# Altium schematic sheet rp3a0-mini-misc.SchDoc
size A4; SheetNumber: 6; SheetTotal: 6
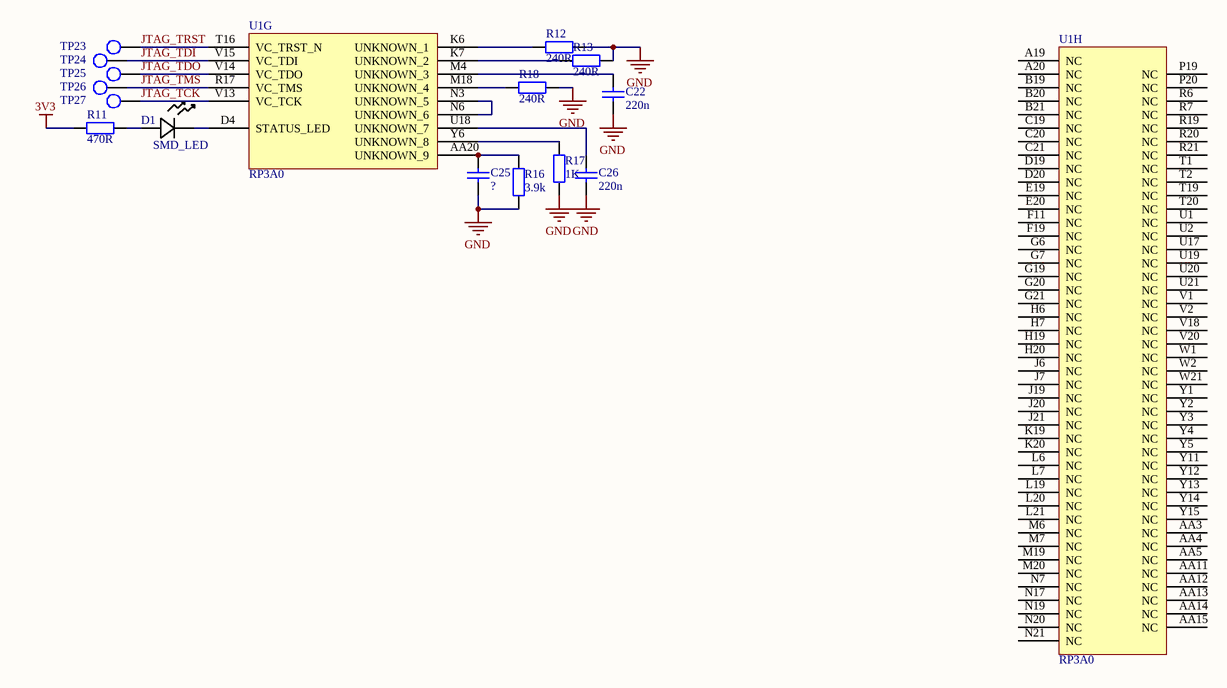
[diagram p0: rp3a0-mini-misc.SchDoc]

## Parts
C22  value 220n  [0402]  (hidden comment: Cap)
C25  Cap  [0402]  (value not drawn)
C26  value 220n  [0402]  (hidden comment: Cap)
D1  SMD_LED  [LED_0603]
R11  value 470R  [RES-0402-SML]  (hidden comment: Res SMD)
R12  value 240R  [RES-0402-SML]  (hidden comment: Res SMD)
R13  value 240R  [RES-0402-SML]  (hidden comment: Res SMD)
R16  value 3.9k  [RES-0402-SML]  (hidden comment: Res SMD)
R17  value 1K  [RES-0402-SML]  (hidden comment: Res SMD)
R18  value 240R  [RES-0402-SML]  (hidden comment: Res SMD)
TP23  TEST_POINT  [TEST_POINT_1.2MM]  (value not drawn)
TP24  TEST_POINT  [TEST_POINT_1.2MM]  (value not drawn)
TP25  TEST_POINT  [TEST_POINT_1.2MM]  (value not drawn)
TP26  TEST_POINT  [TEST_POINT_1.2MM]  (value not drawn)
TP27  TEST_POINT  [TEST_POINT_1.2MM]  (value not drawn)
U1  RP3A0  [RP3A0-BGA]  (parts G,H of 8)

## Nets
3V3: R11.1
GND: C22.1 C25.1 C26.1 R12.2 R13.2 R16.1 R17.1 R18.2
JTAG_TCK: TP27.TP U1.V13(VC_TCK)
JTAG_TDI: TP24.TP U1.V15(VC_TDI)
JTAG_TDO: TP25.TP U1.V14(VC_TDO)
JTAG_TMS: TP26.TP U1.R17(VC_TMS)
JTAG_TRST: TP23.TP U1.T16(VC_TRST_N)
NetC22_2: C22.2 U1.M4(UNKNOWN_3)
NetC25_2: C25.2 R16.2 U1.AA20(UNKNOWN_9)
NetC26_2: C26.2 U1.U18(UNKNOWN_7)
NetD1_1: D1.1 R11.2
NetD1_2: D1.2 U1.D4(STATUS_LED)
NetR12_1: R12.1 U1.K6(UNKNOWN_1)
NetR13_1: R13.1 U1.K7(UNKNOWN_2)
NetR17_2: R17.2 U1.Y6(UNKNOWN_8)
NetR18_1: R18.1 U1.M18(UNKNOWN_4)
NetU1_N3: U1.N3(UNKNOWN_5) U1.N6(UNKNOWN_6)

Not connected (* = marked no-connect by the designer): U1 A19(NC) A20(NC) AA3(NC) AA4(NC) AA5(NC) AA11(NC) AA12(NC) AA13(NC) AA14(NC) AA15(NC) B19(NC) B20(NC) B21(NC) C19(NC) C20(NC) C21(NC) D19(NC) D20(NC) E19(NC) E20(NC) F11(NC) F19(NC) G6(NC) G7(NC) G19(NC) G20(NC) G21(NC) H6(NC) H7(NC) H19(NC) H20(NC) J6(NC) J7(NC) J19(NC) J20(NC) J21(NC) K19(NC) K20(NC) L6(NC) L7(NC) L19(NC) L20(NC) L21(NC) M6(NC) M7(NC) M19(NC) M20(NC) N7(NC) N17(NC) N19(NC) N20(NC) N21(NC) P19(NC) P20(NC) R6(NC) R7(NC) R19(NC) R20(NC) R21(NC) T1(NC) T2(NC) T19(NC) T20(NC) U1(NC) U2(NC) U17(NC) U19(NC) U20(NC) U21(NC) V1(NC) V2(NC) V18(NC) V20(NC) W1(NC) W2(NC) W21(NC) Y1(NC) Y2(NC) Y3(NC) Y4(NC) Y5(NC) Y11(NC) Y12(NC) Y13(NC) Y14(NC) Y15(NC)

## Library data of the parts
C22 C25 C26 = CAP-NONPOL: Capacitor
  C25: Value: ?
R11-R13 R16-R18 = Res SMD: Resistor
TP23-TP27 = TEST_POINT: Test point